# Altium schematic sheet power.SchDoc
size A4
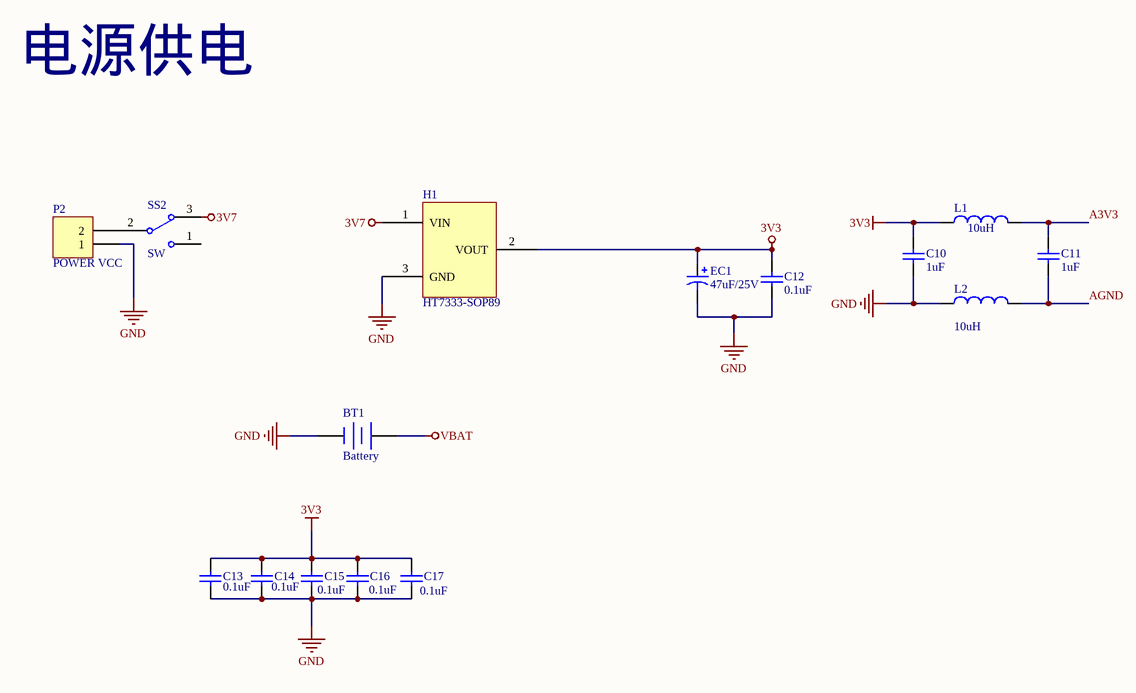
[diagram p0: power.SchDoc]

## Parts
BT1  Battery  [CR1220]
C10  1uF  [1608[0603]]
C11  1uF  [1608[0603]]
C12  value 0.1uF  [1608[0603]]  (hidden comment: Cap)
C13  value 0.1uF  [1608[0603]]  (hidden comment: Cap)
C14  value 0.1uF  [1608[0603]]  (hidden comment: Cap)
C15  value 0.1uF  [1608[0603]]  (hidden comment: Cap)
C16  value 0.1uF  [1608[0603]]  (hidden comment: Cap)
C17  value 0.1uF  [1608[0603]]  (hidden comment: Cap)
EC1  47uF/25V  [47UF 25V SMT Caps]
H1  HT7333-SOP89  [HT7333-SOT89]
L1  10uH  [0805C]
L2  10uH  [0805C]
P2  POWER VCC  [HDR1X2]
SS2  SW  [SS-12F44]

## Nets
3V3: C10.2 C12.1 C13.2 C14.2 C15.2 C16.2 C17.2 EC1.1 H1.2(VOUT) L1.1
3V7: H1.1(VIN) SS2.3
GND: BT1.2(-) C10.1 C12.2 C13.1 C14.1 C15.1 C16.1 C17.1 EC1.2 H1.3(GND) L2.1 P2.1
VBAT: BT1.1(+)
A3V3: C11.2 L1.2
AGND: C11.1 L2.2
NetP2_2: P2.2 SS2.2

Not connected (* = marked no-connect by the designer): SS2 1

## Notes on the sheet
- 电源供电
- Title
- Size:
- Date:
- A4
- Number:
- Time:
- Revision:
- Sheet
- of
- File:

## Library data of the parts
BT1 = Battery: Multicell Battery; Published: 24-Mar-1999; LatestRevisionDate: 17-Jul-2002; LatestRevisionNote: Re-released for DXP Platform.; PackageReference: BAT-2; Publisher: Altium Limited; PackageDescription: Battery; 2 Leads
C10 C11 = Cap: Capacitor; Value: 0.01uF; Published: 8-Jun-2000; LatestRevisionDate: 17-Jul-2002; LatestRevisionNote: Re-released for DXP Platform.; PackageReference: RAD-0.3; Publisher: Altium Limited
C12-C17 = Cap: Capacitor; Published: 8-Jun-2000; LatestRevisionDate: 17-Jul-2002; LatestRevisionNote: Re-released for DXP Platform.; PackageReference: RAD-0.3; Publisher: Altium Limited; PackageDescription: Radial Cap, Thru-Hole; 2 Leads; 0.3 in Pin Spacing
EC1 = Cap Pol1: Polarized Capacitor (Radial); Value: 47uF; Published: 8-Jun-2000; LatestRevisionDate: 17-Jul-2002; LatestRevisionNote: Re-released for DXP Platform.; PackageReference: RB7.6-15; Publisher: Altium Limited; PackageDescription: Polarized Capacitor (Radial); 2 Leads
H1 = HT7333: pin to pad: 1>2 2>3 3>1
L1 L2 = Inductor: Code_IEC: 1005; Published: 8-Jun-2000; LatestRevisionDate: 17-Jul-2002; LatestRevisionNote: Re-released for DXP Platform.; PackageReference: 0402-A; Publisher: Altium Limited; Code_JEITA: 0402; Value: 10uH
P2 = Header 2: Header, 2-Pin; LatestRevisionDate: 17-Jul-2002; LatestRevisionNote: Re-released for DXP Platform.; Publisher: Altium Limited
SS2 = SS-12F44: 拨动开关 SS-12F44 二挡立式 1P2T SS12F44G5 滑动开关